# Altium schematic sheet top.SchDoc: Copper Suicide - Top
size Letter; CheckedBy: J. Brinton; CompanyName: Signal Laboratories, Inc.; DrawnBy: J. Brinton; Engineer: J. Brinton; Address1: 3479 Edison Way; Address2: Menlo Park CA 94025; Address3: +1 (877) 778-8435; Address4: siglabs.com; Revision: 3; SheetNumber: 1; SheetTotal: 47
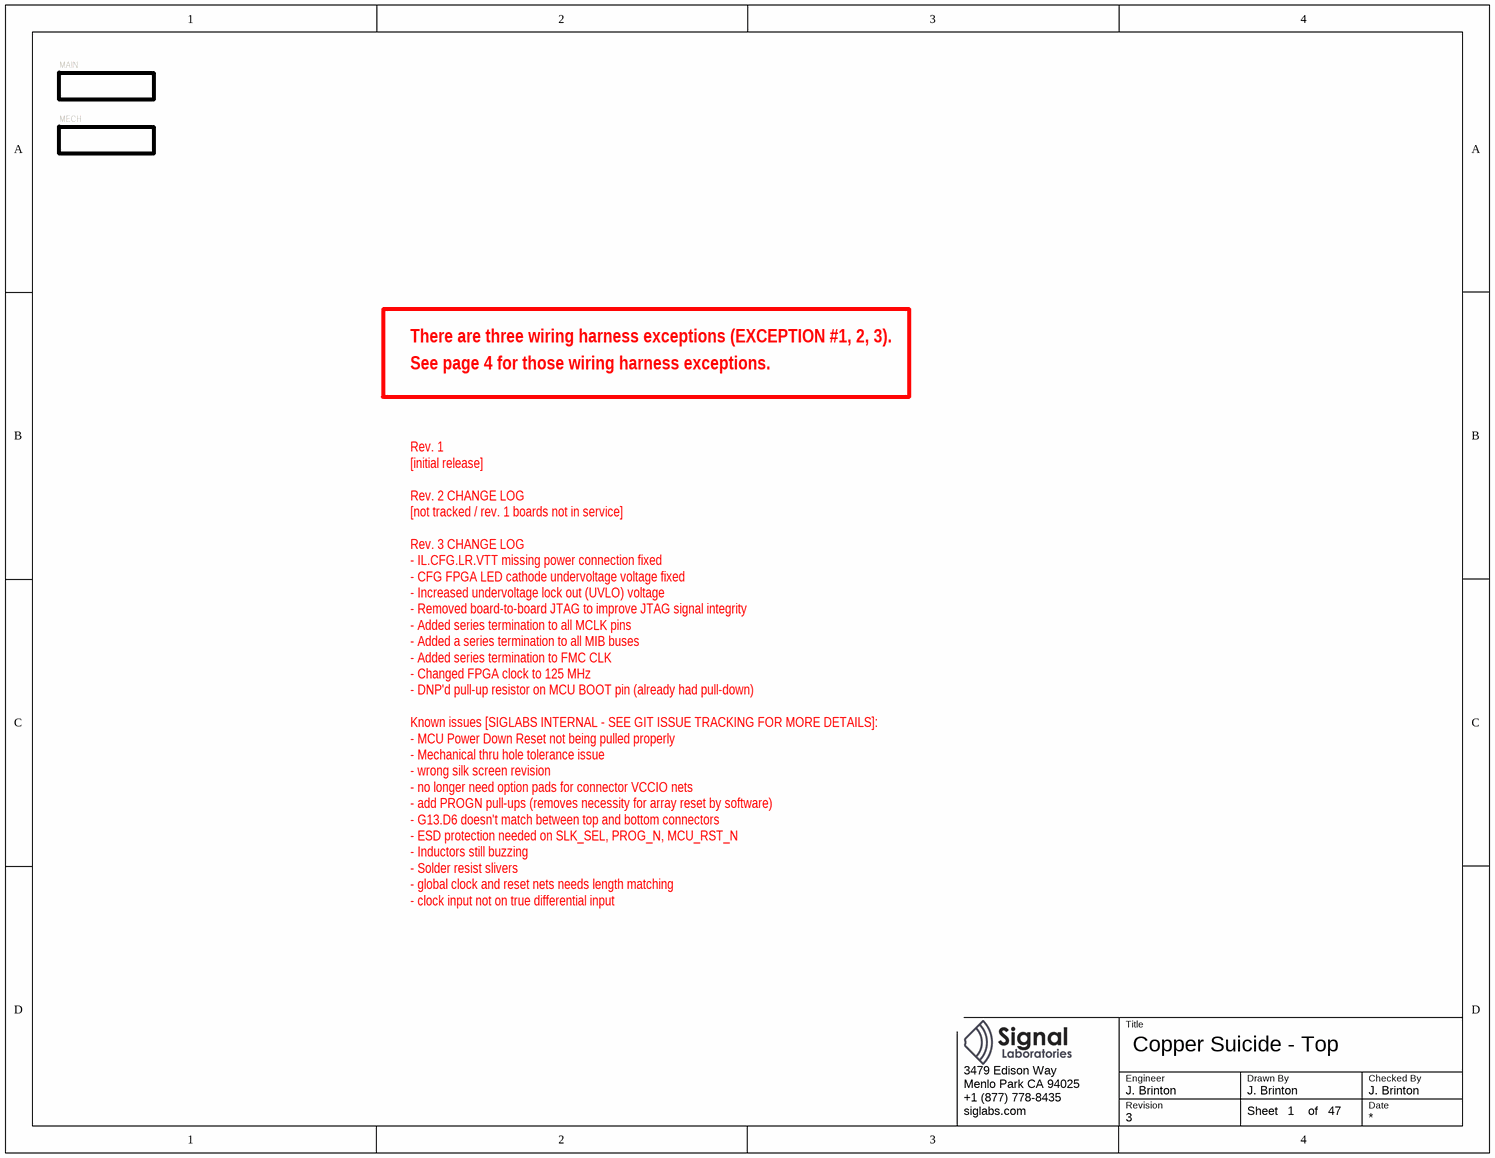
[diagram p0: top.SchDoc]

## Sub-sheets
MAIN = main.SchDoc: no entries
MECH = mechanical.SchDoc: no entries

## Notes on the sheet
- There are three wiring harness exceptions (EXCEPTION #1, 2, 3).
- See page 4 for those wiring harness exceptions.
- Rev. 1
  [initial release]
  Rev. 2 CHANGE LOG
  [not tracked / rev. 1 boards not in service]
  Rev. 3 CHANGE LOG
  - IL.CFG.LR.VTT missing power connection fixed
  - CFG FPGA LED cathode undervoltage voltage fixed
  - Increased undervoltage lock out (UVLO) voltage
  - Removed board-to-board JTAG to improve JTAG signal integrity
  - Added series termination to all MCLK pins
  - Added a series termination to all MIB buses
  - Added series termination to FMC CLK
  - Changed FPGA clock to 125 MHz
  - DNP'd pull-up resistor on MCU BOOT pin (already had pull-down)
  Known issues [SIGLABS INTERNAL - SEE GIT ISSUE TRACKING FOR MORE DETAILS]:
  - MCU Power Down Reset not being pulled properly
  - Mechanical thru hole tolerance issue
  - wrong silk screen revision
  - no longer need option pads for connector VCCIO nets
  - add PROGN pull-ups (removes necessity for array reset by software)
  - G13.D6 doesn't match between top and bottom connectors
  - ESD protection needed on SLK_SEL, PROG_N, MCU_RST_N
  - Inductors still buzzing
  - Solder resist slivers
  - global clock and reset nets needs length matching
  - clock input not on true differential input
- Title
- Engineer
- Revision
- Drawn By
- Checked By
- Date
- Sheet
- of